# Altium schematic sheet Sheet1.SchDoc
size A; SheetNumber: 1; SheetTotal: 1
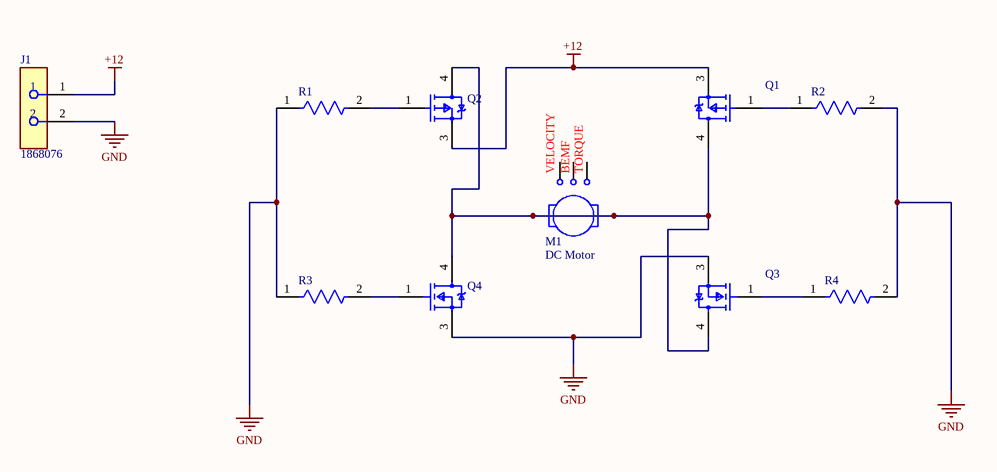
[diagram p0: Sheet1.SchDoc]

## Parts
J1  1868076  [FP-1868076-MFG]
M1  DC Motor
Q1  IRFR5410TRPBF  [FP-PG-TO252-3-MFG]  (value not drawn)
Q2  IRFR5410TRPBF  [FP-PG-TO252-3-MFG]  (value not drawn)
Q3  IRLZ44NSTRLPBF  [FP-PG-TO263-3-MFG]  (value not drawn)
Q4  IRLZ44NSTRLPBF  [FP-PG-TO263-3-MFG]  (value not drawn)
R1  MFR-25FBF52-1K18  [FP-MFR-25-MFG]  (value not drawn)
R2  MFR-25FBF52-1K18  [FP-MFR-25-MFG]  (value not drawn)
R3  MFR-25FBF52-1K18  [FP-MFR-25-MFG]  (value not drawn)
R4  MFR-25FBF52-1K18  [FP-MFR-25-MFG]  (value not drawn)

## Nets
+12: J1.1 Q1.3(S) Q2.3(S)
GND: J1.2 Q3.3(S) Q4.3(S) R1.1 R2.2 R3.1 R4.2
NetM1_1: M1.1 M1.2 Q1.4(D) Q2.4(D) Q3.4(D) Q4.4(D)
NetQ1_1: Q1.1(G) R2.1
NetQ2_1: Q2.1(G) R1.2
NetQ3_1: Q3.1(G) R4.1
NetQ4_1: Q4.1(G) R3.2

Not connected (* = marked no-connect by the designer): M1 3 4 5

## Notes on the sheet
- (in symbol DC Motor) VELOCITY; BEMF; TORQUE

## Library data of the parts
J1 = CMP-00298-00856132-1: 1868076 Conn Terminal Block 2 POS 7.62mm Solder ST Thru-Hole 32A Cardboard; NexarPartId: 856132; Wire Gauge (Min): 10AWG; Voltage: 300V; Number of Positions Per Level: 2; Number of Levels: 1; Current: 10A; Voltage Rating: 500V; Approvals: CSA, UL, cULus; Wire Gauge (Max): 30AWG; Stripping Length: 8mm; RoHS: Compliant; Number of Pins: 2; Housing Color: Green; Color: Green; Height: 19.05mm; Contact Material: Tin; Housing Material: Polyamide; Pitch: 7.62mm; Lead Free: Lead Free; Radiation Hardening: No; Mount: Through Hole; Number of Contacts: 2; Number of Circuits: 2; Number of Positions: 2; Orientation: Straight; Current Rating: 32A; Number of Rows: 1; Termination: Solder; Length: 22.86mm; Weight: 6.000006g; Number of Poles: 2; Width: 26.6mm; Flammability Rating: UL94 V-0; Depth: 12.5mm
M1 = DC Motor: LA: 1.5M; RA: 0.5; KE: 0.05; JM: 250U; BM: 0.1M; TL: 0; SimulationGenericComponent: True; KT: 0.05
Q1 Q2 = CMP-32901-000090-1: MOSFET P-CH 100V 13A DPAK; Manufacturer: Infineon; Threshold Vgs Min: -2V; Pulse Drain Current: -52A; Max Junction Temp: +150°C; Drain To Source Voltage: -100V; Max Forward Diode Voltage: -1.6V; Power Dissipation: 66W; Turn On Delay Time: 15ns; Input Capacitace At Vds: 760pF @ -25V; Rthja Max: 50°C/W; Depletion Mode: False; Number Of P Channels: 1; Reverse Recovery Time: 130ns; Continuous Drain Current: -13A; Drain To Source Resistance: 0.205Ω; Threshold Vgs Max: -4V; Reverse Recovery Charge: 650nC; Gate To Source Voltage: 20V; Gate Charge At Vgs: 58nC @ -10V; Turn Off Delay Time: 45ns; Temperature: -55°C to +150°C; Package: PG-TO252-3; Category: Trans; Footprint Url: http://www.irf.com/package/hexfet/dpakfootprint.pdf; Temperature Range Low: -55°C; Temperature Range High: +150°C; Automotive: No; Device Class L3: MOSFETs; Digikey Description: MOSFET P-CH 100V 13A DPAK; ComponentLink2URL: https://www.infineon.com/dgdl/irfr5410pbf.pdf?fileId=5546d462533600a4015356356f622107; Octopart: https://octopart.com/irfr5410trpbf-infineon-65874169; Device Class L2: Transistors; Lead Free: Yes; Manufacturer Part Number: IRFR5410TRPBF; ComponentLink2Description: Datasheet; Height: 2.52mm; Number Of Channels: 1; Drain To Source Breakdown Voltage: -100V; Device Class L1: Discrete Semiconductors; RoHS: TRUE
Q3 Q4 = CMP-32901-000495-1: MOSFET N-CH 55V 47A D2PAK; Rds On Max: 22mR; Input Capacitance: 1.7nF; Turn-On Delay Time: 11ns; Turn-Off Delay Time: 26ns; Power Dissipation: 110W; Element Configuration: Single; Gate to Source Voltage (Vgs): 16V; Drain to Source Resistance: 35mR; Threshold Voltage: 2V; Max Power Dissipation: 3.8W; Lead Free: Contains Lead; Max Dual Supply Voltage: 55V; Width: 0.38inch; Mount: Surface Mount; Continuous Drain Current (ID): 47A; Min Operating Temperature: -55°C; Number of Pins: 3; REACH SVHC: No SVHC; Height: 0.19inch; Length: 0.42inch; Case/Package: D2PAK; Drain to Source Breakdown Voltage: 55V; Packaging: Tape and Reel; Drain to Source Voltage (Vdss): 55V; Halogen Free: Halogen Free; RoHS Compliant: Yes; Max Operating Temperature: 175°C
R1-R4 = CMP-03413-000001-1: RES 1.18K OHM 1/4W 1% AXIAL; Manufacturer: Yageo; Value: 1.18kΩ; Temperature Coefficient: 100ppm/°C; Power Rating: 0.25W; Voltage Rating: 250V; Temperature: -55°C to +155°C; Automotive: No; Temperature Range High: +155°C; Mouser Description: Metal Film Resistors 1.18K OHM 1/4W 1%; Digikey Description: RES 1.18K OHM 1/4W 1% AXIAL; Lead Free: Yes; Tolerance: 1%; ComponentLink2Description: Datasheet; ComponentLink2URL: https://www.yageo.com/upload/media/product/products/datasheet/lr/Yageo_LR_MFR_1.pdf; Temperature Range Low: -55°C; Package: MFR-25; Ipc Land Pattern Name: RESAD1000W75L680D260; Composition: Metal Film; Category: Res; Octopart: https://octopart.com/mfr-25fbf52-1k18-yageo-56251681; Series: MFR; Device Class L2: Resistors; Height: 2.6mm; Resistance: 1.18kΩ; Device Class L3: Through-Hole Resistors; Manufacturer Part Number: MFR-25FBF52-1K18; RoHS: TRUE; Device Class L1: Passive Components